# EasyEDA schematic arduino pos print bilet_2020-11-19_14-39-20.json
TITLE: Контроллер печати номера на POS принтере; REV: 1.0; Date: 2020-11-19; Sheet: 1/1; Company: General Programs
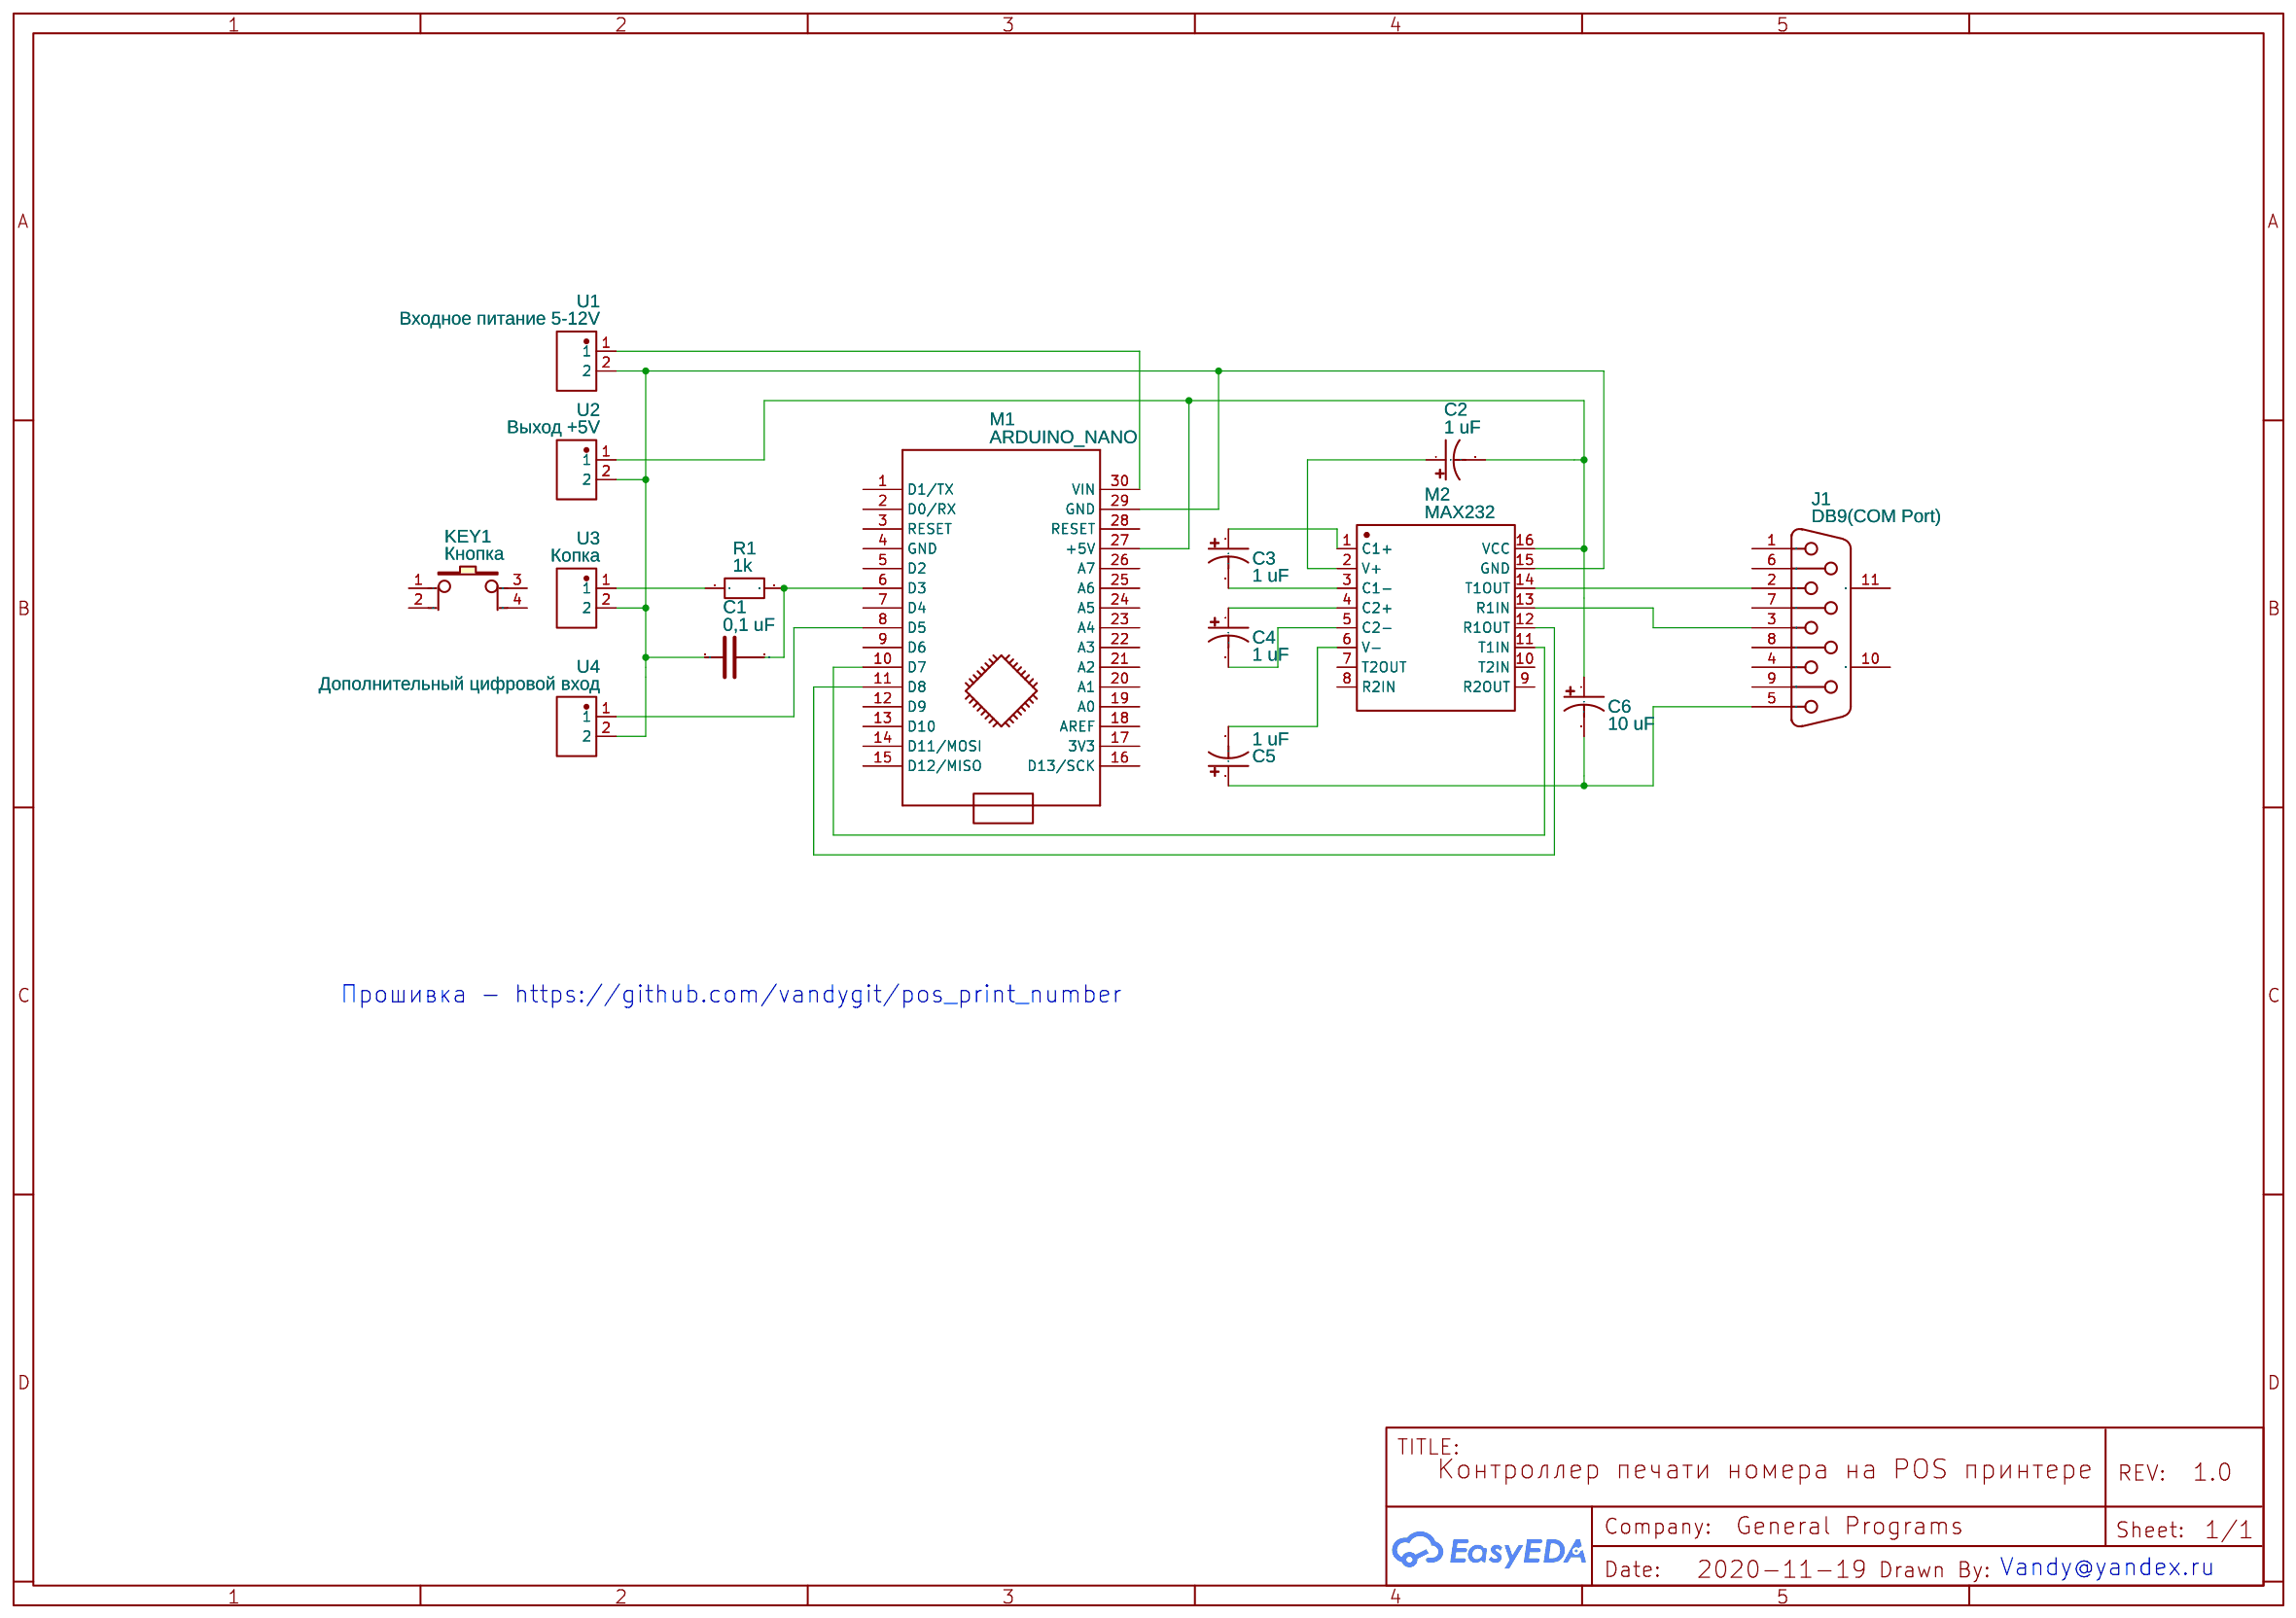
[diagram p0: schematic sheet]

## Parts
C1  0,1 uF  [TWO_IO]
C2  1 uF  [CPOL-RADIAL-10UF-25V]
C3  1 uF  [CPOL-RADIAL-10UF-25V]
C4  1 uF  [CPOL-RADIAL-10UF-25V]
C5  1 uF  [CPOL-RADIAL-10UF-25V]
C6  10 uF  [CPOL-RADIAL-10UF-25V]
J1  DB9(COM Port)  [DB9-TH_DT10121-M5N3-4F]
KEY1  Кнопка  [KEY-TH_4P-L6.0-W6.0-P4.50]
M1  ARDUINO_NANO  [ARDUINO_NANO]
M2  MAX232  [DIP16]
R1  1k  [RES-TH_BD2.2-L6.5-P10.50-D0.9]
U1  Входное питание 5-12V  [CONN-TH_XY302V-3.5-2P]
U2  Выход +5V  [CONN-TH_XY302V-3.5-2P]
U3  Копка  [CONN-TH_XY302V-3.5-2P]
U4  Дополнительный цифровой вход  [CONN-TH_XY302V-3.5-2P]

## Library data of the parts
C1 = CAPACITOR
C2-C6 = CAP_POLPTH2: Capacitor Polarized; Contributor: SparkFun
J1 = DS1037-09MNAKT74-0CC: Supplier: LCSC; Manufacturer: CONNFLY; image: //image.lceda.cn/szlcsc/C75750.jpg; Supplier Part: C75750
KEY1 = button6*6*8.5: Supplier Part: C59980; Supplier: LCSC; Manufacturer: ReliaPro; image: http://image.lceda.cn/szlcsc/C59980.jpg
M1 = ARDUINO_NANO: sourceId: KGSeAWhDB
M2 = MAX232
R1 = CFR0W4J0102A50_C66649: Supplier: LCSC; Supplier Part: C66649; Manufacturer: Uniroyal Elec; Manufacturer Part: CFR0W4J0102A50; Contributor: LCSC
U1-U4 = XY302V-3.5-2P: Supplier: LCSC; Supplier Part: C784940; Manufacturer: Ningbo Xinlaiya Elec.; Contributor: LCSC

## Nets
Net-(C1-P$1): C1.P$1 M1.29(GND) M2.15(GND) U1.2 U2.2 U3.2 U4.2
Net-(C1-P$2): C1.P$2 M1.6(D3) R1.2
Net-(C2-1): C2.1(+) M2.2(V+)
Net-(C2-2): C2.2(-) C6.1(+) M1.27(+5V) M2.16(VCC) U2.1
Net-(C3-1): C3.1(+) M2.1(C1+)
Net-(C3-2): C3.2(-) M2.3(C1-)
Net-(C4-1): C4.1(+) M2.4(C2+)
Net-(C4-2): C4.2(-) M2.5(C2-)
Net-(C5-1): C5.1(+) C6.2(-) J1.5
Net-(C5-2): C5.2(-) M2.6(V-)
Net-(J1-2): J1.2 M2.14(T1OUT)
Net-(J1-3): J1.3 M2.13(R1IN)
Net-(M1-8): M1.8(D5) U4.1
Net-(M1-10): M1.10(D7) M2.11(T1IN)
Net-(M1-11): M1.11(D8) M2.12(R1OUT)
Net-(M1-30): M1.30(VIN) U1.1
Net-(R1-1): R1.1 U3.1

Not connected (* = marked no-connect by the designer): J1 1 4 6 7 8 9 10(MH1) 11(MH2); KEY1 1 2 3 4; M1 1(D1/TX) 2(D0/RX) 3(RESET) 4(GND) 5(D2) 7(D4) 9(D6) 12(D9) 13(D10) 14(D11/MOSI) 15(D12/MISO) 16(D13/SCK) 17(3V3) 18(AREF) 19(A0) 20(A1) 21(A2) 22(A3) 23(A4) 24(A5) 25(A6) 26(A7) 28(RESET); M2 7(T2OUT) 8(R2IN) 9(R2OUT) 10(T2IN)

## Notes on the sheet
- Прошивка - https://github.com/vandygit/pos_print_number
- Vandy@yandex.ru
